# Altium schematic sheet Data_converter.SchDoc
size A4; SheetNumber: 13; SheetTotal: 13
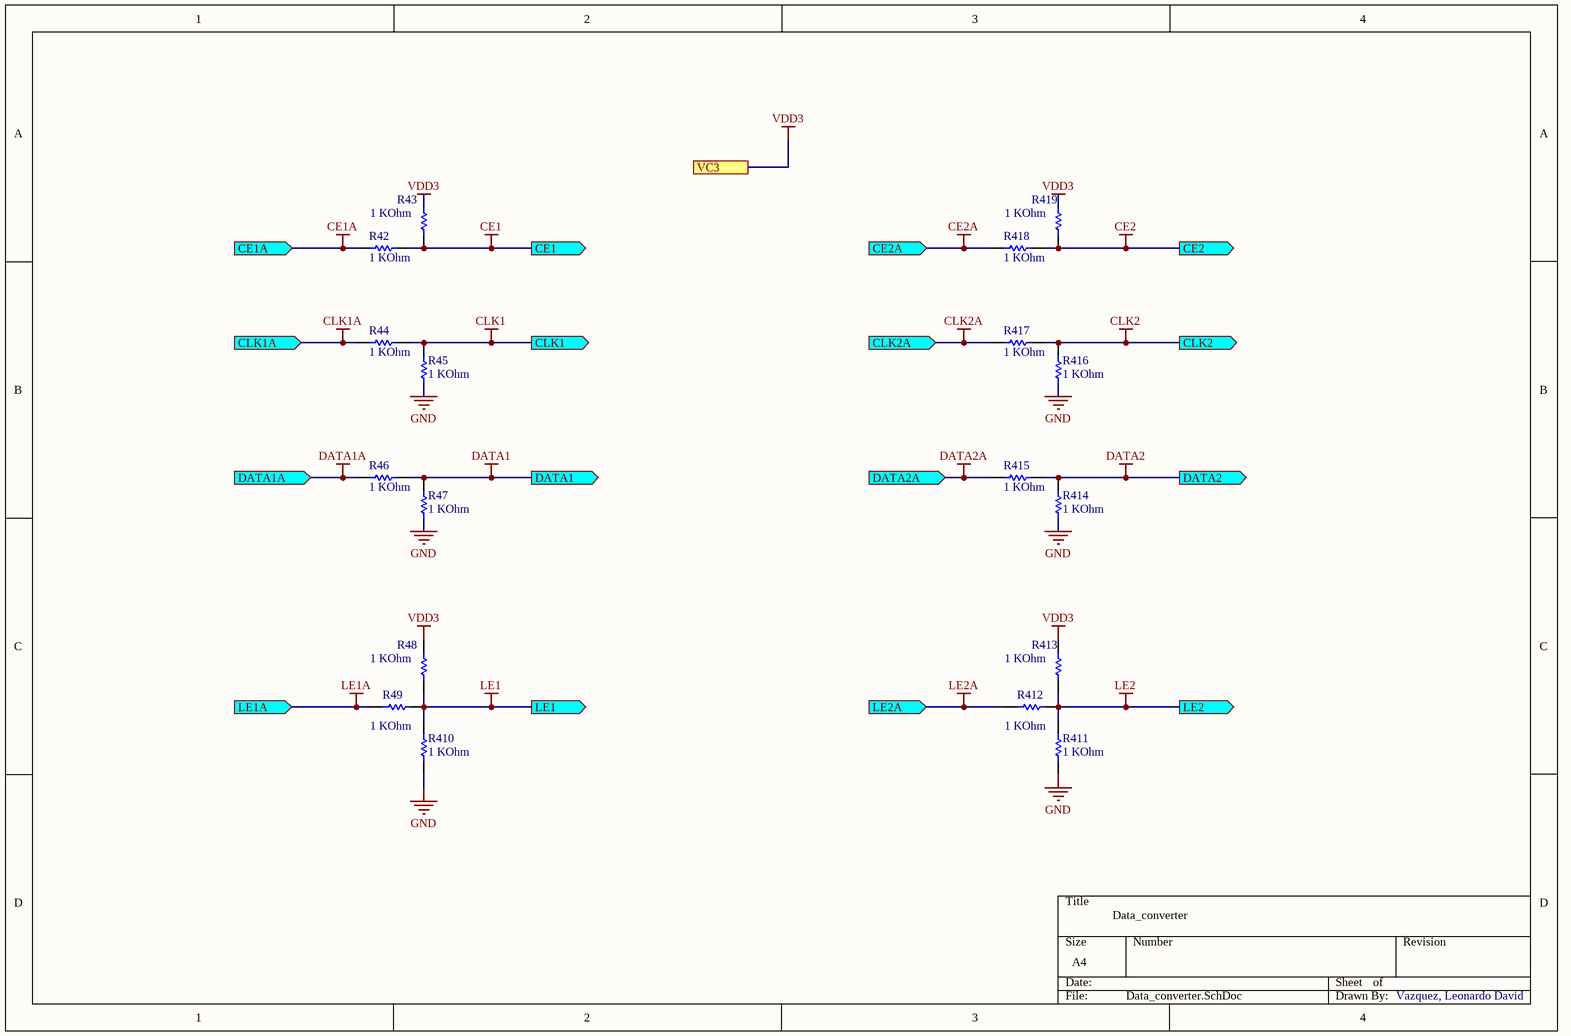
[diagram p0: Data_converter.SchDoc]

## Parts
R42  1 KOhm  [RESC2013X60X40ML20T25]
R43  1 KOhm  [RESC2013X60X40ML20T25]
R44  1 KOhm  [RESC2013X60X40ML20T25]
R45  1 KOhm  [RESC2013X60X40ML20T25]
R46  1 KOhm  [RESC2013X60X40ML20T25]
R47  1 KOhm  [RESC2013X60X40ML20T25]
R48  1 KOhm  [RESC2013X60X40ML20T25]
R49  1 KOhm  [RESC2013X60X40ML20T25]
R410  1 KOhm  [RESC2013X60X40ML20T25]
R411  1 KOhm  [RESC2013X60X40ML20T25]
R412  1 KOhm  [RESC2013X60X40ML20T25]
R413  1 KOhm  [RESC2013X60X40ML20T25]
R414  1 KOhm  [RESC2013X60X40ML20T25]
R415  1 KOhm  [RESC2013X60X40ML20T25]
R416  1 KOhm  [RESC2013X60X40ML20T25]
R417  1 KOhm  [RESC2013X60X40ML20T25]
R418  1 KOhm  [RESC2013X60X40ML20T25]
R419  1 KOhm  [RESC2013X60X40ML20T25]

## Ports
CE1 (out, see ADF4351_10X2_v1[3D], Sintetizador1[1B]), CE1A (in, see ADF4351_10X2_v1[2D], ADF4351_10X2_v1[1D], PIC18F4550[2A]), CE2 (out, see ADF4351_10X2_v1[3D], Sintetizador2[1B]), CE2A (in, see ADF4351_10X2_v1[2D], ADF4351_10X2_v1[1D], PIC18F4550[2A]), CLK1 (out, see ADF4351_10X2_v1[3D], Sintetizador1[1B]), CLK1A (in, see ADF4351_10X2_v1[2D]), CLK2 (out, see ADF4351_10X2_v1[3D], Sintetizador2[1B]), CLK2A (in, see ADF4351_10X2_v1[2D]), DATA1 (out, see ADF4351_10X2_v1[3D], Sintetizador1[1B]), DATA1A (in, see ADF4351_10X2_v1[2D]), DATA2 (out, see ADF4351_10X2_v1[3D], Sintetizador2[1B]), DATA2A (in, see ADF4351_10X2_v1[2D]), LE1 (out, see ADF4351_10X2_v1[3D], Sintetizador1[1B]), LE1A (in, see ADF4351_10X2_v1[2D], ADF4351_10X2_v1[1D], PIC18F4550[2A]), LE2 (out, see ADF4351_10X2_v1[3D], Sintetizador2[1B]), LE2A (in, see ADF4351_10X2_v1[2D], ADF4351_10X2_v1[1D], PIC18F4550[2A]), VC3 (see ADF4351_10X2_v1[3C])

## Nets
CE1: R42.1 R43.1 ; port CE1
CE1A: R42.2 ; port CE1A
CE2: R418.1 R419.1 ; port CE2
CE2A: R418.2 ; port CE2A
CLK1: R44.1 R45.2 ; port CLK1
CLK1A: R44.2 ; port CLK1A
CLK2: R416.2 R417.1 ; port CLK2
CLK2A: R417.2 ; port CLK2A
DATA1: R46.1 R47.2 ; port DATA1
DATA1A: R46.2 ; port DATA1A
DATA2: R414.2 R415.1 ; port DATA2
DATA2A: R415.2 ; port DATA2A
GND: R45.1 R47.1 R410.1 R411.1 R414.1 R416.1
LE1: R48.1 R49.1 R410.2 ; port LE1
LE1A: R49.2 ; port LE1A
LE2: R411.2 R412.1 R413.1 ; port LE2
LE2A: R412.2 ; port LE2A
VDD3: R43.2 R48.2 R413.2 R419.2 ; port VC3

## Notes on the sheet
- Data_converter
- Vazquez, Leonardo David

## Library data of the parts
R42-R49 R410-R419 = CMP-2001-00580-1: Manufacturer: Panasonic; Part Number: ERA6AEB101V